# Altium schematic sheet PowerAndInput.SchDoc
size A4
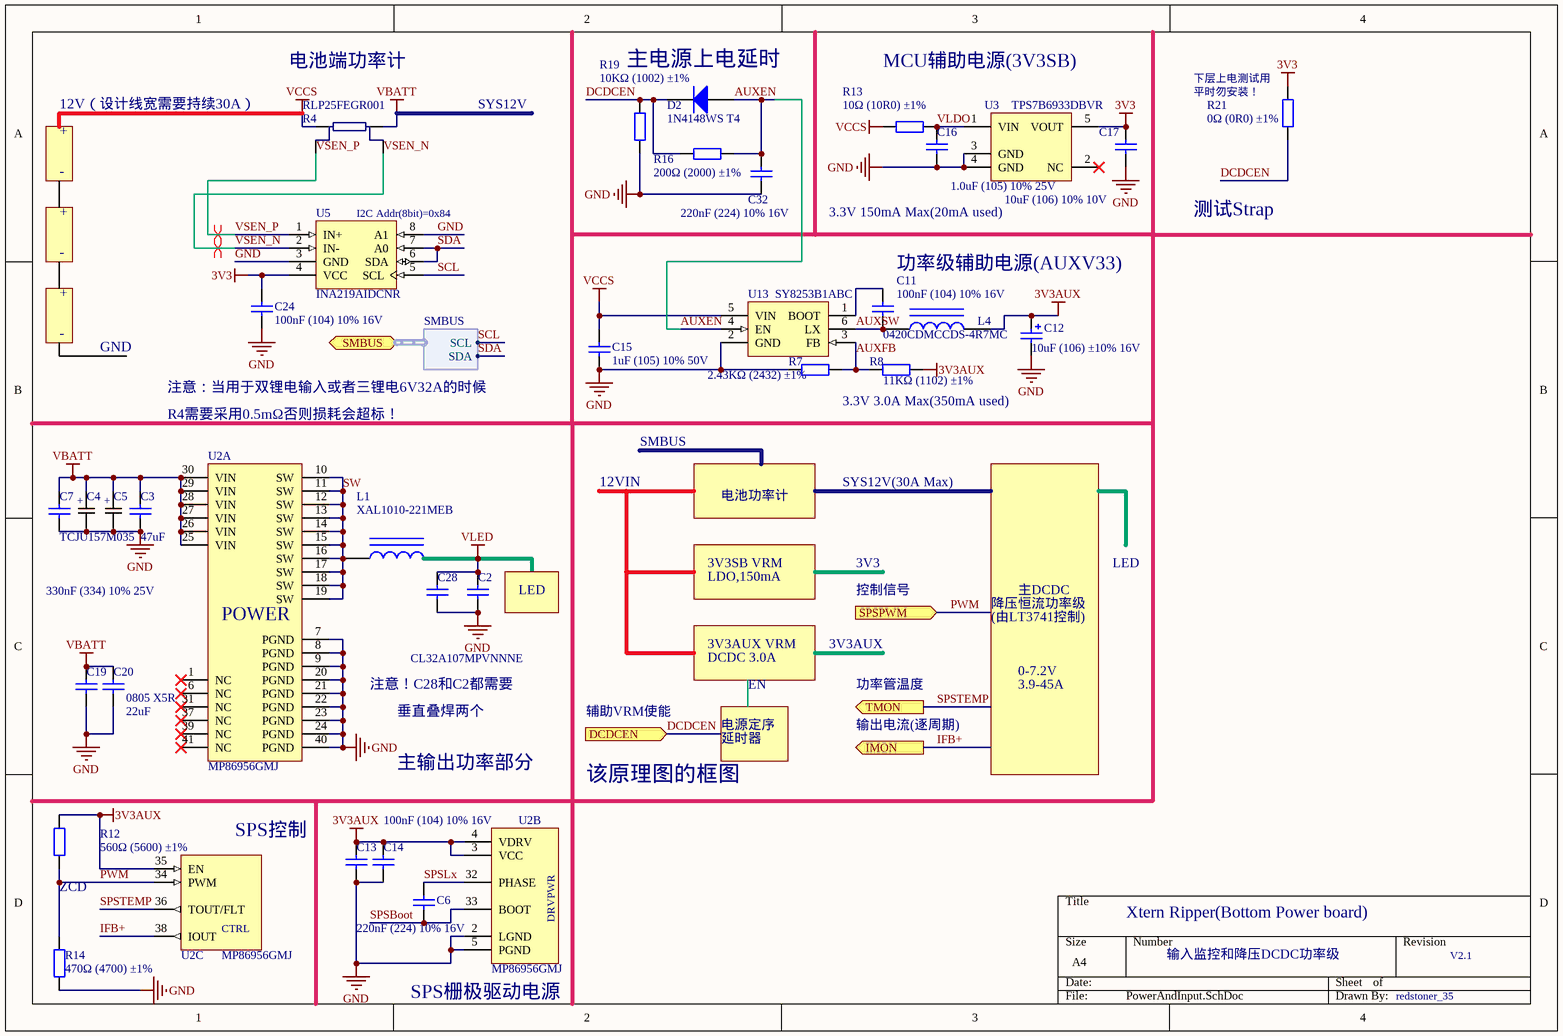
[diagram p0: PowerAndInput.SchDoc]

## Parts
C2  CC1210KKX5RBB476  [1210C]  (value not drawn)
C3  value 47uF  [1210C]  (hidden comment: CC1210KKX5RBB476)
C4  TCJU157M035  [CAPMP7362X41N]
C5  TCJU157M035  [CAPMP7362X41N]  (value not drawn)
C6  220nF (224) 10% 16V  [0402_C]
C7  330nF (334) 10% 25V  [0603_C]
C11  100nF (104) 10% 16V  [0402_C]
C12  10uF (106) ±10% 16V  [CASE-A_3216]
C13  100nF (104) 10% 16V  [0402_C]  (value not drawn)
C14  100nF (104) 10% 16V  [0402_C]
C15  1uF (105) 10% 50V  [0603_C]
C16  1.0uF (105) 10% 25V  [0402_C]
C17  10uF (106) 10% 10V  [0603_C]
C19  0805 X5R  [0805C]  (value not drawn)
C20  0805 X5R  value 22uF  [0805C]
C24  100nF (104) 10% 16V  [0402_C]
C28  CL32A107MPVNNNE  [1210C]
C32  220nF (224) 10% 16V  [0402_C]
D2  1N4148WS T4  [SOD-323]
L1  XAL1010-221MEB  [XAL1010-XXXME]
L4  0420CDMCCDS-4R7MC  [0420CDMCCDS-***MC]
R4  RLP25FEGR001  [2512-Virtual4Wire]
R7  2.43KΩ (2432) ±1%  [0402_R]
R8  11KΩ (1102) ±1%  [0402_R]
R12  560Ω (5600) ±1%  [0402_R]
R13  10Ω (10R0) ±1%  [0402_R]
R14  470Ω (4700) ±1%  [0402_R]
R16  200Ω (2000) ±1%  [0402_R]
R19  10KΩ (1002) ±1%  [0402_R]
R21  0Ω (0R0) ±1%  [0402_R]
U2  MP86956GMJ  [TDA21490]  (parts A,B,C of 3)
U3  TPS7B6933DBVR  [SOT95P245X110-5N]
U5  INA219AIDCNR  [SOT23-8]
U13  SY8253B1ABC  [SOT95P245X110-6N]

## Ports
DCDCEN (in), IMON (out), SMBUS (harness SMBUS), SPSPWM (in), TMON (out)

## Harnesses
SMBUS: SDA, SCL

## Nets
3V3: C17.2 C24.2 R21.2 U3.5(VOUT) U5.4(VCC)
3V3AUX: C12.1 C13.2 C14.2 L4.2 R8.2 R12.2 U2.3(VCC) U2.4(VDRV) U2.35(EN)
GND: C2.1 C3.1 C4.2(-) C5.2(-) C7.1 C12.2 C13.1 C14.1 C15.1 C16.1 C17.1 C19.1 C20.1 C24.1 C28.1 C32.2 R7.1 R14.1 R19.1 U2.2(LGND) U2.5(PGND) U2.7(PGND) U2.8(PGND) U2.9(PGND) U2.20(PGND) U2.21(PGND) U2.22(PGND) U2.23(PGND) U2.24(PGND) U2.40(PGND) U3.3(GND) U3.4(GND) U5.3(GND) U5.8(A1) U13.2(GND)
VBATT: C3.2 C4.1(+) C5.1(+) C7.2 C19.2 C20.2 R4.0(CIN) U2.25(VIN) U2.26(VIN) U2.27(VIN) U2.28(VIN) U2.29(VIN) U2.30(VIN)
VCCS: C15.2 R4.1(CIN) R13.1 U13.5(VIN)
VLED: C2.2 C28.2 L1.2
AUXEN: C32.1 D2.1(A) R16.2 U13.4(EN)
AUXFB: R7.2 R8.1 U13.3(FB)
AUXSW: C11.1 L4.1 U13.6(LX)
DCDCEN: D2.2(K) R16.1 R19.2 R21.1 ; port DCDCEN
IFB+: U2.38(IOUT) ; port IMON
PWM: R12.1 R14.2 U2.34(PWM) ; port SPSPWM
SCL: U5.5(SCL) ; port SMBUS.SCL
SDA: U5.6(SDA) U5.7(A0) ; port SMBUS.SDA
SPSBoot: C6.1 U2.33(BOOT)
SPSLx: C6.2 U2.32(PHASE)
SPSTEMP: U2.36(TOUT/FLT) ; port TMON
SW: L1.1 U2.10(SW) U2.11(SW) U2.12(SW) U2.13(SW) U2.14(SW) U2.15(SW) U2.16(SW) U2.17(SW) U2.18(SW) U2.19(SW)
VLDO: C16.2 R13.2 U3.1(VIN)
VSEN_N: R4.2(CIN) U5.2(IN-)
VSEN_P: R4.3(CIN) U5.1(IN+)
NetC11_2: C11.2 U13.1(BOOT)

Not connected (* = marked no-connect by the designer): U2 1(NC)* 6(NC)* 31(NC)* 37(NC)* 39(NC)* 41(NC)*; U3 2(NC)*

## Layout directives
differential pair: VSEN_N, VSEN_P

## Notes on the sheet
- 12V（设计线宽需要持续30A）
- 电池端功率计
- SYS12V
- 主电源上电延时
- MCU辅助电源(3V3SB)
- 下层上电测试用
- 平时勿安装！
- +
- -
- (near U5) I2C Addr(8bit)=0x84
- 3.3V 150mA Max(20mA used)
- 测试Strap
- (near C11) 功率级辅助电源(AUXV33)
- GND
- 注意：当用于双锂电输入或者三锂电6V32A的时候
- R4需要采用0.5mΩ否则损耗会超标！
- SMBUS
- 3.3V 3.0A Max(350mA used)
- 12VIN
- 电池功率计
- SYS12V(30A Max)
- 3V3SB VRM
- LDO,150mA
- 3V3
- LED
- (near C2) LED
- 3V3AUX VRM
- 3V3AUX
- 控制信号
- 降压恒流功率级
- (由LT3741控制)
- 主DCDC
- 注意！C28和C2都需要
- 垂直叠焊两个
- 辅助VRM使能
- DCDC 3.0A
- EN
- 功率管温度
- 0-7.2V
- 3.9-45A
- 主输出功率部分
- 该原理图的框图
- 电源定序
- 延时器
- 输出电流(逐周期)
- SPS控制
- (near R12) ZCD
- Xtern Ripper(Bottom Power board)
- 输入监控和降压DCDC功率级
- V2.1
- (near U2) SPS栅极驱动电源
- redstoner_35
- (in symbol MP86957, part A) POWER
- (in symbol MP86957, part B) DRVPWR
- (in symbol MP86957, part C) CTRL

## Library data of the parts
C2 C28 = Cap: 1210 MLCC X5R 16V 10%; Value: 47uF; Published: 8-Jun-2000; LatestRevisionDate: 17-Jul-2002; LatestRevisionNote: Re-released for DXP Platform.; PackageReference: RAD-0.3; Publisher: Altium Limited; PackageDescription: Radial Cap, Thru-Hole; 2 Leads; 0.3 in Pin Spacing
C3 = Cap: 1210 MLCC X5R 16V 10%; Published: 8-Jun-2000; LatestRevisionDate: 17-Jul-2002; LatestRevisionNote: Re-released for DXP Platform.; PackageReference: RAD-0.3; Publisher: Altium Limited; PackageDescription: Radial Cap, Thru-Hole; 2 Leads; 0.3 in Pin Spacing
C4 C5 = TCJU157M035R0100E: 35V 150uF Conductive Polymer Solid Capacitor 100mR ESR. 7362 Size
C6 C32 = 0402 220nF (224) 10% 16V: 贴片电容; ComponentLink1Description: 供应商链接; ComponentLink1URL: http://www.szlcsc.com/product/details_17456.html; Package: 0402; Supplier: LC; SuppliersPartNumber: C16772
C7 = 0603 330nF (334) 10% 25V: 贴片电容; ComponentLink1Description: 供应商链接; ComponentLink1URL: http://www.szlcsc.com/product/details_1967.html; Package: 0603; Supplier: LC; SuppliersPartNumber: C1615
C11 C13 C14 C24 = 0402 100nF (104) 10% 16V: 贴片电容; ComponentLink1Description: 供应商链接; ComponentLink1URL: http://www.szlcsc.com/product/details_1877.html; Package: 0402; Supplier: LC; SuppliersPartNumber: C1525
C12 = 3216 10uF (106) 10% 16V: 钽电容; ComponentLink1Description: 供应商链接; ComponentLink1URL: http://www.szlcsc.com/product/details_7643.html; Package: 3216; Supplier: LC; SuppliersPartNumber: C7171
C15 = 0603 1uF (105) 10% 50V: 贴片电容; ComponentLink1Description: 供应商链接; ComponentLink1URL: http://www.szlcsc.com/product/details_16531.html; Package: 0603; Supplier: LC; SuppliersPartNumber: C15849
C16 = 0402 1.0uF (105) 10% 25V: 贴片电容; ComponentLink1Description: 供应商链接; ComponentLink1URL: http://www.szlcsc.com/product/details_53938.html; Package: 0402; Supplier: LC; SuppliersPartNumber: C52923
C17 = 0603 10uF (106) 10% 10V: 贴片电容; ComponentLink1Description: 供应商链接; ComponentLink1URL: http://www.szlcsc.com/product/details_20411.html; Package: 0603; Supplier: LC; SuppliersPartNumber: C19702
C19 = Cap: Capacitor; Value: 22uF; Published: 8-Jun-2000; LatestRevisionDate: 17-Jul-2002; LatestRevisionNote: Re-released for DXP Platform.; PackageReference: RAD-0.3; Publisher: Altium Limited; PackageDescription: Radial Cap, Thru-Hole; 2 Leads; 0.3 in Pin Spacing
C20 = Cap: Capacitor; Published: 8-Jun-2000; LatestRevisionDate: 17-Jul-2002; LatestRevisionNote: Re-released for DXP Platform.; PackageReference: RAD-0.3; Publisher: Altium Limited; PackageDescription: Radial Cap, Thru-Hole; 2 Leads; 0.3 in Pin Spacing
D2 = SOD-323 1N4148WS T4: 二极管; ComponentLink1Description: 供应商链接; ComponentLink1URL: http://www.szlcsc.com/product/details_2485.html; Package: SOD-323; Supplier: LC; SuppliersPartNumber: C2128
L1 = Inductor Iron: Coilcraft Inductor XAL1010 Series; Value: 0.22uH; Published: 24-Mar-1999; LatestRevisionDate: 17-Jul-2002; LatestRevisionNote: Re-released for DXP Platform.; PackageReference: AXIAL-0.9; Publisher: Altium Limited; PackageDescription: Axial Device, Thru-Hole; 2 Leads; 0.9 in Pin Spacing
L4 = Inductor Iron: Magnetic-Core Inductor; Value: 4.7uH; Published: 24-Mar-1999; LatestRevisionDate: 17-Jul-2002; LatestRevisionNote: Re-released for DXP Platform.; PackageReference: AXIAL-0.9; Publisher: Altium Limited; PackageDescription: Axial Device, Thru-Hole; 2 Leads; 0.9 in Pin Spacing
R4 = shunt: 2512 1mΩ合金检流电阻 3W
R7 R8 R21 = 0402 0Ω (0R0) 1%: 贴片电阻; ComponentLink1Description: 供应商链接; ComponentLink1URL: http://www.szlcsc.com/product/details_17853.html; Package: 0402; Supplier: LC
  R7 R8: SuppliersPartNumber: C????
  R21: SuppliersPartNumber: C17168
R12 = 0402 22KΩ (2202) 1%: 贴片电阻; ComponentLink1Description: 供应商链接; ComponentLink1URL: http://www.szlcsc.com/product/details_26511.html; Package: 0402; Supplier: LC; SuppliersPartNumber: C??????
R13 = 0402 10Ω (10R0) 1%: 贴片电阻; ComponentLink1Description: 供应商链接; ComponentLink1URL: http://www.szlcsc.com/product/details_25820.html; Package: 0402; Supplier: LC; SuppliersPartNumber: C25077
R14 = 0402 470Ω (4700) 1%: 贴片电阻; ComponentLink1Description: 供应商链接; ComponentLink1URL: http://www.szlcsc.com/product/details_25860.html; Package: 0402; Supplier: LC; SuppliersPartNumber: C25117
R16 = 0402 200Ω (2000) 1%: 贴片电阻; ComponentLink1Description: 供应商链接; ComponentLink1URL: http://www.szlcsc.com/product/details_25830.html; Package: 0402; Supplier: LC; SuppliersPartNumber: C25087
R19 = 0402 10KΩ (1002) 1%: 贴片电阻; ComponentLink1Description: 供应商链接; ComponentLink1URL: http://www.szlcsc.com/product/details_26487.html; Package: 0402; Supplier: LC; SuppliersPartNumber: C25744
U2 = MP86957: MPS 70A INTELLI-PHASE SPS in 5x6mm QFN41
U3 = TPS7B6933DBVR: 150mA 40V max input Ultra low Iq LDO,fixed 3.3V output
U5 = INA219AIDCNR: 26V Dual Direction 12bit I2C Power Gauge SOT23-8
U13 = SY8120: 3A 23V Input 500KHz Sync step down converter